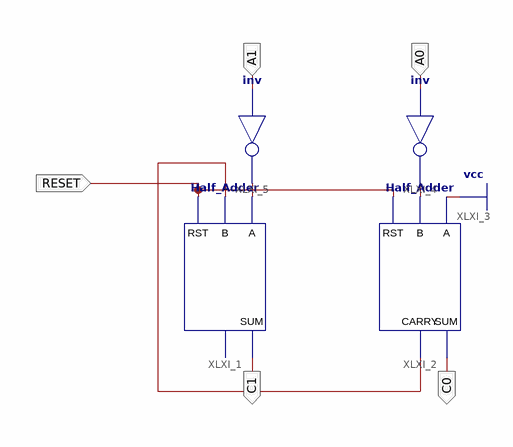
[diagram p0: schematic sheet 1]
// Xilinx ISE schematic Two_Bit_Twos_Complement.sch (spartan6) as structural Verilog: 4 symbols, 5 ports
module Two_Bit_Twos_Complement (
  input  A1,
  input  A0,
  input  RESET,
  output C0,
  output C1
);

  wire XLXN_1, XLXN_3, XLXN_4;

  Half_Adder XLXI_1 (.A(XLXN_4), .B(XLXN_1), .RST(RESET), .SUM(C1));  // open: CARRY
  Half_Adder XLXI_2 (.A(1'b1), .B(XLXN_3), .CARRY(XLXN_1), .RST(RESET), .SUM(C0));
  not XLXI_4 (XLXN_3, A0);
  not XLXI_5 (XLXN_4, A1);
endmodule
